# EAGLE design FAD4 (EAGLE 9.4.2)
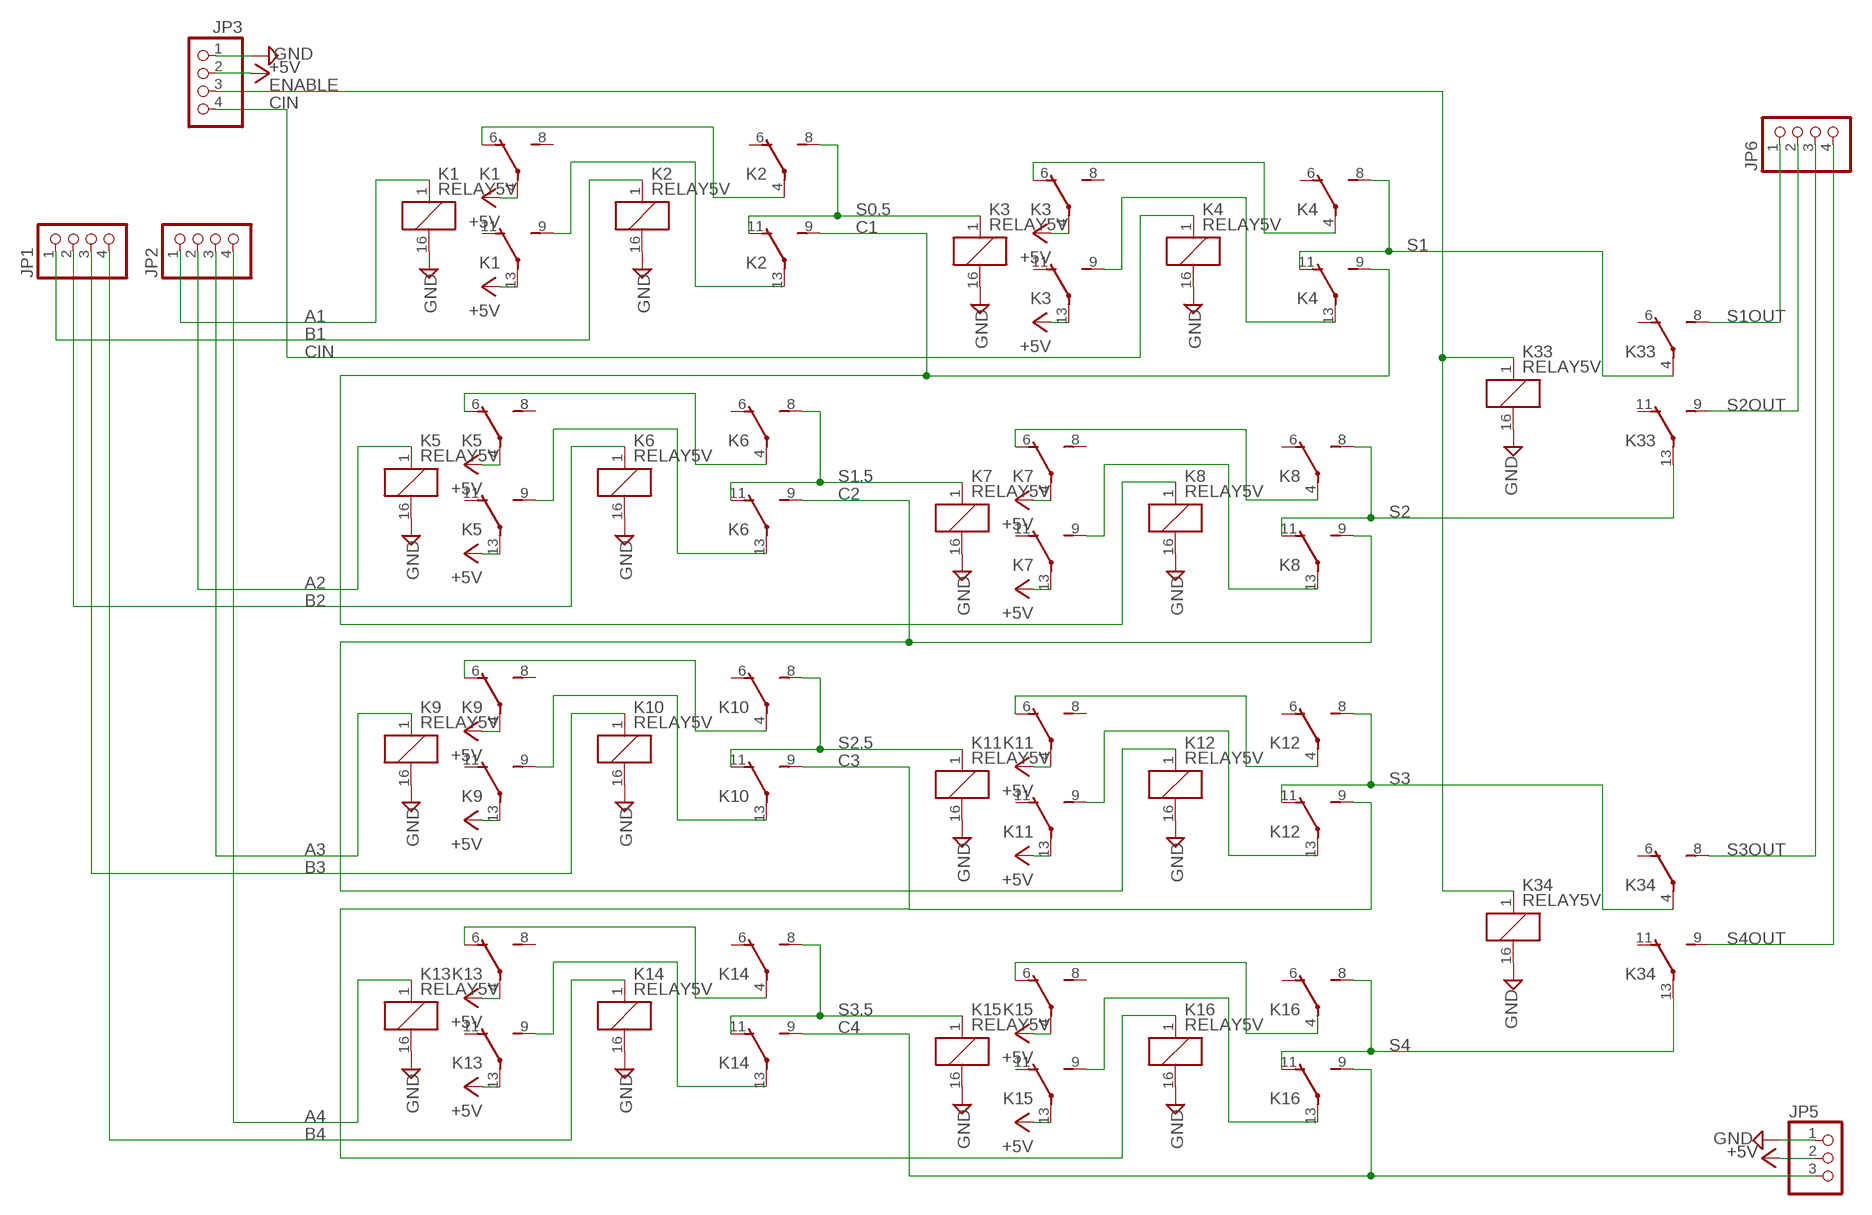
[diagram p0: schematic, sheet 1]

## Parts
JP1  PINHD-1X4  [1X04]
JP2  PINHD-1X4  [1X04]
JP3  PINHD-1X4  [1X04]
JP5  PINHD-1X3  [1X03]
JP6  PINHD-1X4  [1X04]
K1  RELAY5V  [DS-BT]
K2  RELAY5V  [DS-BT]
K3  RELAY5V  [DS-BT]
K4  RELAY5V  [DS-BT]
K5  RELAY5V  [DS-BT]
K6  RELAY5V  [DS-BT]
K7  RELAY5V  [DS-BT]
K8  RELAY5V  [DS-BT]
K9  RELAY5V  [DS-BT]
K10  RELAY5V  [DS-BT]
K11  RELAY5V  [DS-BT]
K12  RELAY5V  [DS-BT]
K13  RELAY5V  [DS-BT]
K14  RELAY5V  [DS-BT]
K15  RELAY5V  [DS-BT]
K16  RELAY5V  [DS-BT]
K33  RELAY5V  [DS-BT]
K34  RELAY5V  [DS-BT]

## Nets
+5V: JP3.2 JP5.2 K1.4(2:P) K1.13(3:P) K3.4(2:P) K3.13(3:P) K5.4(2:P) K5.13(3:P) K7.4(2:P) K7.13(3:P) K9.4(2:P) K9.13(3:P) K11.4(2:P) K11.13(3:P) K13.4(2:P) K13.13(3:P) K15.4(2:P) K15.13(3:P)
A1: JP2.1 K1.1(1:+)
A2: JP2.2 K5.1(1:+)
A3: JP2.3 K9.1(1:+)
A4: JP2.4 K13.1(1:+)
B1: JP1.1 K2.1(1:+)
B2: JP1.2 K6.1(1:+)
B3: JP1.3 K10.1(1:+)
B4: JP1.4 K14.1(1:+)
C1: K2.9(3:S) K4.9(3:S) K8.1(1:+)
C2: K6.9(3:S) K8.9(3:S) K12.1(1:+)
C3: K10.9(3:S) K12.9(3:S) K16.1(1:+)
C4: JP5.3 K14.9(3:S) K16.9(3:S)
CIN: JP3.4 K4.1(1:+)
ENABLE: JP3.3 K33.1(1:+) K34.1(1:+)
GND: JP3.1 JP5.1 K1.16(1:-) K2.16(1:-) K3.16(1:-) K4.16(1:-) K5.16(1:-) K6.16(1:-) K7.16(1:-) K8.16(1:-) K9.16(1:-) K10.16(1:-) K11.16(1:-) K12.16(1:-) K13.16(1:-) K14.16(1:-) K15.16(1:-) K16.16(1:-) K33.16(1:-) K34.16(1:-)
N$1: K3.9(3:S) K4.13(3:P)
N$2: K1.9(3:S) K2.13(3:P)
N$3: K1.6(2:O) K2.4(2:P)
N$4: K3.6(2:O) K4.4(2:P)
N$5: K5.9(3:S) K6.13(3:P)
N$6: K5.6(2:O) K6.4(2:P)
N$7: K7.9(3:S) K8.13(3:P)
N$8: K7.6(2:O) K8.4(2:P)
N$9: K9.9(3:S) K10.13(3:P)
N$10: K9.6(2:O) K10.4(2:P)
N$11: K11.9(3:S) K12.13(3:P)
N$12: K11.6(2:O) K12.4(2:P)
N$13: K13.9(3:S) K14.13(3:P)
N$14: K13.6(2:O) K14.4(2:P)
N$15: K15.9(3:S) K16.13(3:P)
N$16: K15.6(2:O) K16.4(2:P)
S0.5: K2.8(2:S) K2.11(3:O) K3.1(1:+)
S1: K4.8(2:S) K4.11(3:O) K33.4(2:P)
S1.5: K6.8(2:S) K6.11(3:O) K7.1(1:+)
S1OUT: JP6.1 K33.8(2:S)
S2: K8.8(2:S) K8.11(3:O) K33.13(3:P)
S2.5: K10.8(2:S) K10.11(3:O) K11.1(1:+)
S2OUT: JP6.2 K33.9(3:S)
S3: K12.8(2:S) K12.11(3:O) K34.4(2:P)
S3.5: K14.8(2:S) K14.11(3:O) K15.1(1:+)
S3OUT: JP6.3 K34.8(2:S)
S4: K16.8(2:S) K16.11(3:O) K34.13(3:P)
S4OUT: JP6.4 K34.9(3:S)
Unconnected: K1.8(2:S) K1.11(3:O) K2.6(2:O) K3.8(2:S) K3.11(3:O) K4.6(2:O) K5.8(2:S) K5.11(3:O) K6.6(2:O) K7.8(2:S) K7.11(3:O) K8.6(2:O) K9.8(2:S) K9.11(3:O) K10.6(2:O) K11.8(2:S) K11.11(3:O) K12.6(2:O) K13.8(2:S) K13.11(3:O) K14.6(2:O) K15.8(2:S) K15.11(3:O) K16.6(2:O) K33.6(2:O) K33.11(3:O) K34.6(2:O) K34.11(3:O)

## Library data of the parts
JP1-JP3 JP6 = pinhead:PINHD-1X4: PIN HEADER
JP5 = pinhead:PINHD-1X3: PIN HEADER
K1-K16 K33 K34 = My:RELAY: DS-BT RELAYS 4,000 V BREAKDOWN VOLTAGE NAiS Source: http://www.mew-europe.com/.. en_ds_61005_0010.pdf

## Board
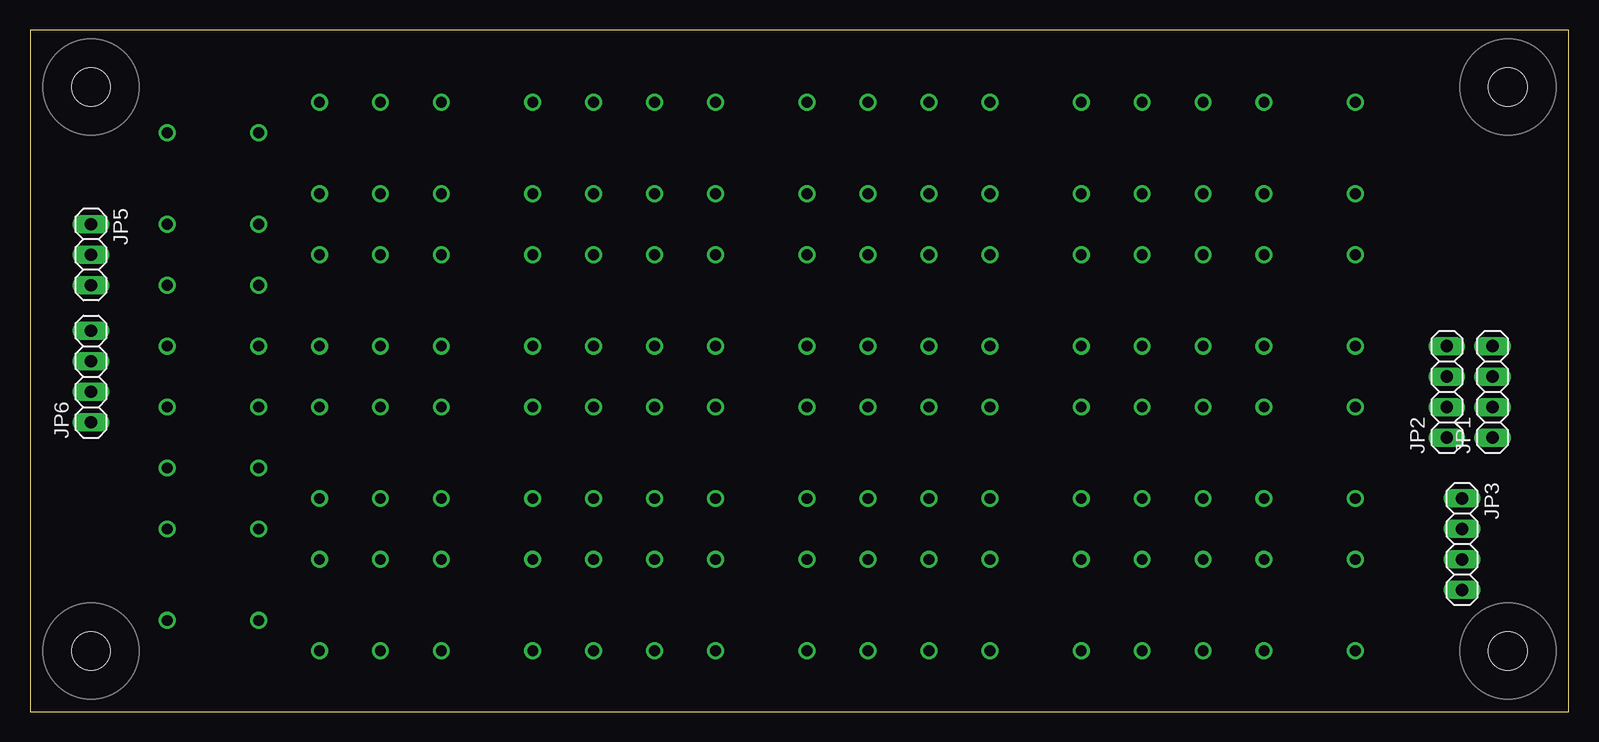
[diagram p1: board, top side]
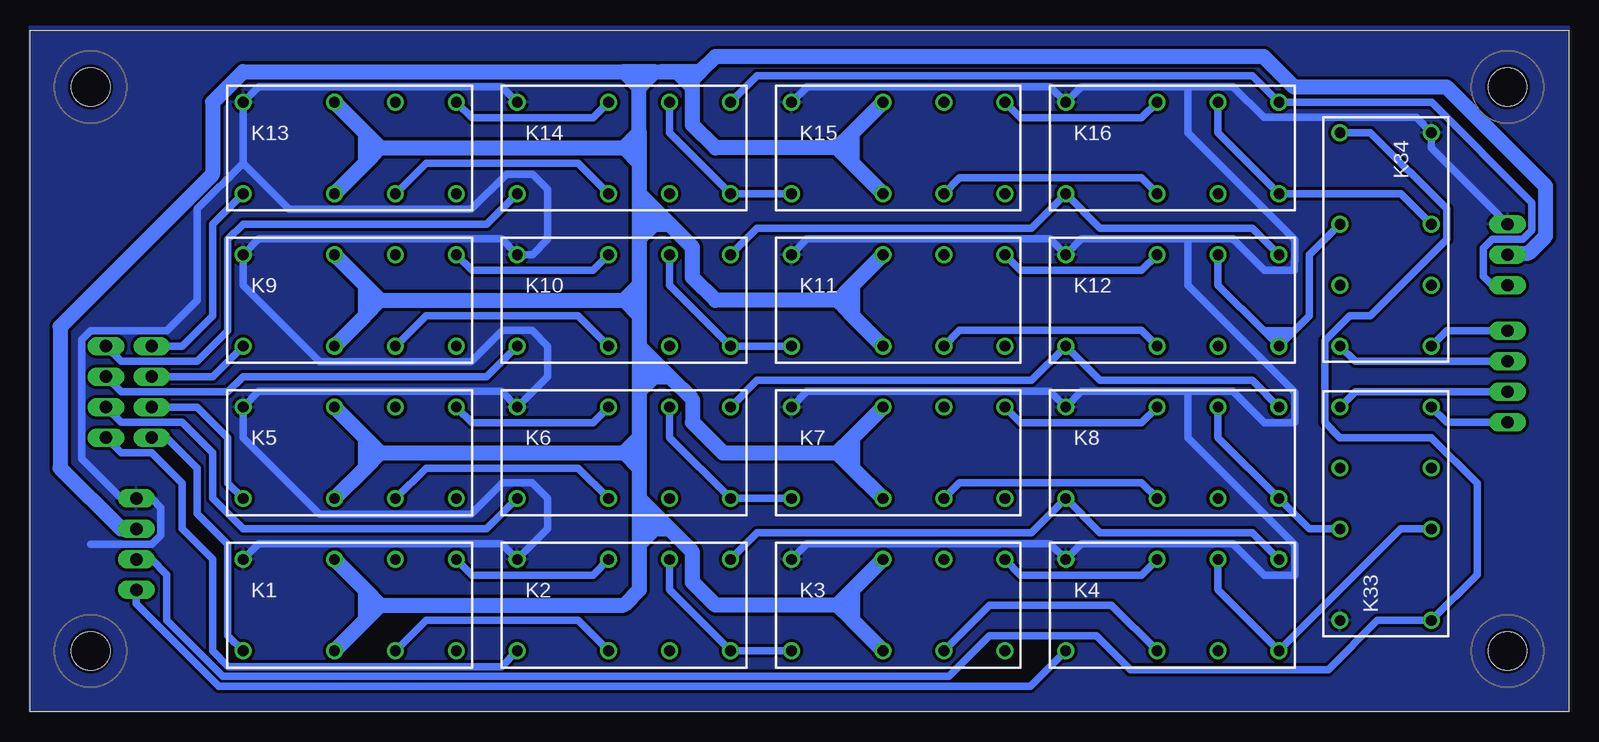
[diagram p2: board, bottom side, seen from below]

Size 128.25 x 56.82 mm. Coordinates in mm from the lower left corner, seen from the top.
Outline: 0,0 128.25,0 128.25,56.82 0,56.82 0,0
Copper layers (1*16): Top 0.0356mm / dielectric 1.5011mm / Bottom 0.0356mm
Design rules "formitaminimum": minimum track width 5mil, minimum drill 0.5994mm, track to track 0.2007mm, track to pad 0.2007mm, pad to pad 0.2007mm, via to via 0.2007mm, smd to smd 0mil, copper to edge 0mil, drill to drill 1mil, minimum pad ring 10mil, minimum via ring 8mil, stop-mask expansion 4mil, vias tented up to drill 1mm, thermal gap 10mil

### Footprints (pad centres in the part's own frame; a part is rotated, then mirrored left to right if it is on the bottom)
1X04 = drill 1.016 long: 1 -3.81,0; 2 -1.27,0; 3 1.27,0; 4 3.81,0
1X03 = drill 1.016 long: 1 -2.54,0; 2 0,0; 3 2.54,0
DS-BT = drill 0.9: 1 -8.89,-3.81; 4 -1.27,-3.81; 6 3.81,-3.81; 8 8.89,-3.81; 9 8.89,3.81; 11 3.81,3.81; 13 -1.27,3.81; 16 -8.89,3.81
HOLE_3.2 = hole 3.2: 0,0

### Placement (x,y rotation side)
JP1  121.92,26.67 90 top
JP2  118.11,26.67 90 top
JP3  119.38,13.97 270 top
JP5  5.08,38.1 270 top
JP6  5.08,27.94 90 top
K1  101.6,8.89 0 bottom
K2  78.74,8.89 0 bottom
K3  55.88,8.89 0 bottom
K4  33.02,8.89 0 bottom
K5  101.6,21.59 0 bottom
K6  78.74,21.59 0 bottom
K7  55.88,21.59 0 bottom
K8  33.02,21.59 0 bottom
K9  101.6,34.29 0 bottom
K10  78.74,34.29 0 bottom
K11  55.88,34.29 0 bottom
K12  33.02,34.29 0 bottom
K13  101.6,46.99 0 bottom
K14  78.74,46.99 0 bottom
K15  55.88,46.99 0 bottom
K16  33.02,46.99 0 bottom
K33  15.24,16.51 90 bottom
K34  15.24,39.37 270 bottom
U$1  [HOLE_3.2]  5.08,5.08 0 top
U$2  [HOLE_3.2]  5.08,52.07 0 top
U$3  [HOLE_3.2]  123.19,5.08 0 top
U$4  [HOLE_3.2]  123.19,52.07 0 top

### Tracks (layer width: path | path; a pad name or v marks a point on that pad's centre or on a via)
+5V
  Bottom 1.27: 60.96,46.99 59.69,45.72 | 59.69,45.72 K15.4 | 77.47,48.26 77.47,46.99 | 77.47,46.99 77.47,45.72 | 77.47,45.72 77.47,43.18 | 77.47,43.18 77.47,41.91 | 77.47,41.91 77.47,40.64 | 77.47,40.64 77.47,39.37 | 77.47,39.37 77.47,35.56 | 77.47,35.56 77.47,34.29 | 77.47,34.29 77.47,33.02 | 77.47,33.02 77.47,30.48 | 77.47,30.48 77.47,29.21 | 77.47,29.21 77.47,27.94 | 77.47,27.94 77.47,26.67 | 77.47,26.67 77.47,22.86 | 77.47,22.86 77.47,21.59 | 77.47,21.59 77.47,20.32 | 77.47,20.32 77.47,17.78 | 77.47,17.78 77.47,16.51 | 77.47,16.51 77.47,15.24 | 77.47,15.24 77.47,13.97 | 77.47,13.97 77.47,10.16 78.74,8.89 99.06,8.89 | 77.47,15.24 76.2,15.24 | 76.2,15.24 74.93,15.24 | 74.93,15.24 73.03,13.34 73.03,10.79 71.12,8.89 60.96,8.89 | 60.96,8.89 59.69,10.16 | 59.69,10.16 K3.13 | K3.4 59.69,7.62 | 59.69,7.62 60.96,8.89 | K7.13 59.69,22.86 | 59.69,22.86 60.96,21.59 | 74.93,27.94 73.03,26.04 73.03,24.13 70.48,21.59 60.96,21.59 | 76.2,27.94 74.93,27.94 | 76.2,27.94 77.47,27.94 | K7.4 59.69,20.32 | 59.69,20.32 60.96,21.59 | 77.47,29.21 76.2,27.94 | 76.2,27.94 77.47,26.67 | 76.2,40.64 74.93,40.64 | 60.96,34.29 60.33,34.92 | 60.33,34.92 59.69,35.56 | 59.69,35.56 K11.13 | K11.4 59.69,33.02 | 59.69,33.02 60.33,33.66 | 60.33,33.66 60.96,34.29 | 60.33,34.92 60.33,33.66 | 76.2,40.64 77.47,41.91 | 76.2,40.64 77.47,39.37 | K15.13 59.69,48.26 | 59.69,48.26 60.96,46.99 | 59.69,45.72 59.69,48.26 | 59.69,35.56 59.69,33.02 | 59.69,22.86 59.69,20.32 | 59.69,10.16 59.69,7.62 | 76.2,15.24 77.47,16.51 | 76.2,15.24 77.47,13.97 | K13.13 100.33,48.26 | 100.33,48.26 99.06,46.99 | 99.06,46.99 78.74,46.99 | 77.47,46.99 78.74,46.99 | 78.74,46.99 77.47,48.26 | 78.74,46.99 77.47,45.72 | K13.4 100.33,45.72 | 100.33,45.72 99.69,46.35
  Bottom 1.27: 99.69,46.35 99.06,46.99 | 100.33,48.26 100.33,45.72 | K9.13 100.33,35.56 | 100.33,35.56 99.06,34.29 | 99.06,34.29 78.74,34.29 | 77.47,34.29 78.74,34.29 | K9.4 100.33,33.02 | 100.33,33.02 99.06,34.29 | 100.33,35.56 100.33,33.02 | 77.47,35.56 78.74,34.29 | 78.74,34.29 77.47,33.02 | K5.13 100.33,22.86 | 100.33,22.86 99.06,21.59 | 99.06,21.59 78.74,21.59 | 77.47,21.59 78.74,21.59 | 99.06,21.59 100.33,20.32 | 100.33,20.32 K5.4 | 77.47,22.86 78.74,21.59 | 78.74,21.59 77.47,20.32 | K1.13 100.33,10.16 | 100.33,10.16 99.06,8.89 | 99.06,8.89 100.33,7.62 | 100.33,7.62 K1.4 | 74.93,40.64 73.03,38.73 73.03,36.2 71.12,34.29 60.96,34.29 | 60.96,46.99 71.12,46.99 73.03,48.9 73.03,52.07 | 76.2,40.64 77.47,40.64 | 100.33,22.86 100.33,20.32 | 100.33,10.16 100.33,7.62 | 76.19,53.35 77.47,53.35 | 77.47,53.35 78.74,53.35 | 78.74,53.35 78.73,53.34 | 72.39,53.34 71.12,54.61 25.4,54.61 22.86,52.07 10.16,52.07 1.91,43.82 1.91,39.64 3.32,38.23 4.95,38.23 JP5.2 | 72.39,53.34 73.66,53.34 | 73.66,53.34 74.3,53.34 | 75.57,53.35 75.56,53.34 74.3,53.34 | 73.03,52.07 73.03,52.7 | 72.39,53.34 73.03,52.7 | 73.03,52.7 73.66,53.34 | 77.47,48.26 77.47,52.07 | 77.47,52.07 77.47,53.35 | 76.19,53.35 77.47,52.07 | 76.19,53.35 75.57,53.35 | 77.47,52.07 78.74,53.34 78.74,53.35 | 75.57,53.35 72.4,53.35 72.39,53.34 | 73.03,52.07 74.3,53.34 | 74.93,15.24 77.47,17.78 | 74.93,27.94 77.47,30.48 | 74.93,40.64 77.47,43.18 | 78.74,53.35 110.49,53.35 113.03,50.8 113.03,44.79 125.73,32.09 125.73,20.32 120.65,15.24 JP3.2 | 99.69,46.35
A1
  Bottom 0.61: K1.1 111.76,6.35 111.76,13.97 114.3,16.51 114.3,20.32 116.84,22.86 JP2.1
A2
  Bottom 0.61: 116.84,25.4 JP2.2 114.3,25.4 111.76,22.86 111.76,19.05 K5.1
A3
  Bottom 0.61: JP2.3 113.03,27.94 K9.1
A4
  Bottom 0.61: JP2.4 115.57,30.48 113.03,33.02 113.03,40.64 K13.1
B1
  Bottom 0.61: K2.1 88.94,3.77 111.72,3.77 113.03,5.08 113.03,12.7 115.57,15.24 115.57,19.05 118.11,21.59 120.65,21.59 JP1.1
B2
  Bottom 0.61: K6.1 90.17,15.24 110.49,15.24 113.03,17.78 113.03,21.59 115.57,24.13 120.65,24.13 JP1.2
B3
  Bottom 0.61: JP1.3 120.65,26.67 111.76,26.67 110.49,27.94 90.17,27.94 K10.1
B4
  Bottom 0.61: K14.1 90.17,40.64 110.49,40.64 111.76,39.37 111.76,31.75 114.3,29.21 120.65,29.21 JP1.4
C1
  Bottom 0.61: K4.9 26.35,14.92 39.05,14.92 K8.1 44.77,14.92 67.63,14.92 K2.9
C2
  Bottom 0.61: K8.9 26.35,27.62 39.05,27.62 K12.1 44.77,27.62 67.63,27.62 K6.9
C3
  Bottom 0.61: K12.9 26.35,40.32 39.05,40.32 K16.1 44.77,40.32 67.63,40.32 K10.9
C4
  Bottom 0.61: K14.9 67.63,53.02 26.35,53.02 K16.9 11.41,50.8 3.05,42.44 3.05,40.12 3.79,39.37 3.81,39.37 6.35,39.37 6.37,39.37 7.11,38.62 7.11,37.58 7.11,36.32 6.35,35.56 JP5.3
CIN
  Bottom 0.61: K4.1 44.84,2.15 112.52,2.15 119.38,9.01 JP3.4
ENABLE
  Bottom 0.61: K34.1 16.51,48.26 10.16,41.91 10.16,39.37 16.51,33.02 18.22,33.02 20.32,30.92 20.32,24.13 19.05,22.86 11.43,22.86 7.62,19.05 7.62,11.43 K33.1 15.92,7.62 20.03,3.52 36.54,3.52 39.37,6.35 48.26,6.35 51.65,2.96 112.18,2.96 116.84,7.62 116.84,11.43 118.11,12.7 JP3.3
GND
  Bottom 0.61: 31.75,52.11 40.6,52.11 K16.16 43.22,52.11 63.5,52.11 63.5,52.07 K15.16 | 31.75,52.11 27.98,52.11 25.4,49.53 12.7,49.53 K34.16 11.43,46.99 JP5.1 | K11.16 63.46,39.41 43.22,39.41 K12.16 40.6,39.41 31.75,39.41 | K7.16 63.46,26.71 43.22,26.71 K8.16 40.6,26.71 31.75,26.71 | K3.16 63.46,14.01 43.22,14.01 K4.16 40.6,14.01 27.98,14.01 25.36,11.39 22.86,11.39 | 31.75,26.71 27.98,26.71 25.36,24.09 22.86,24.09 22.82,24.13 22.82,26.63 31.75,35.56 31.75,39.41 | 31.75,39.41 27.98,39.41 25.36,36.79 22.86,36.79 | 31.75,26.71 31.75,22.86 22.82,13.93 22.82,11.43 22.86,11.39 | 31.75,52.11 31.75,48.26 22.82,39.33 22.82,37.56 22.86,37.52 22.86,36.83 | 110.49,45.72 K13.16 109.18,52.11 88.94,52.11 K14.16 | 110.49,45.72 106.64,41.87 91.48,41.87 88.54,44.81 86.36,44.81 85.09,43.54 85.09,39.37 86.36,38.1 K10.16 88.94,39.41 109.18,39.41 K9.16 110.49,35.56 104.1,29.17 91.48,29.17 88.86,31.79 86.4,31.79 85.09,30.48 85.09,27.94 K6.16 88.94,26.71 109.18,26.71 K5.16 110.49,22.86 104.1,16.47 91.48,16.47 88.86,19.09 86.4,19.09 85.09,17.78 85.09,15.24 K2.16 88.94,14.01 109.18,14.01 K1.16 | 22.82,11.39 22.86,11.39 | 123.19,13.97 118.11,13.97 118.09,13.97 117.35,14.71 117.35,17.02 118.11,17.78 JP3.1 120.65,17.78 123.95,21.08 123.95,31 123.21,31.75 123.19,31.75 116.84,31.75 114.3,34.29 114.3,41.91 110.49,45.72
  pour Bottom (isolate 0.254): 0,57.15 0,0 128.27,0 128.27,57.15
N$1
  Bottom 0.61: K4.13 35.6,11.39 45.68,11.39 K3.9
N$2
  Bottom 0.61: K2.13 81.32,11.39 91.4,11.39 K1.9
N$3
  Bottom 0.61: K2.4 82.55,7.62 95.25,7.62 K1.6
N$4
  Bottom 0.61: K4.4 38.1,8.89 48.26,8.89 K3.6
N$5
  Bottom 0.61: K6.13 81.32,24.09 91.4,24.09 K5.9
N$6
  Bottom 0.61: K6.4 82.55,20.32 95.25,20.32 K5.6
N$7
  Bottom 0.61: K8.13 35.6,24.09 45.68,24.09 K7.9
N$8
  Bottom 0.61: K8.4 35.6,19.09 50.76,19.09 K7.6
N$9
  Bottom 0.61: K10.13 81.32,36.79 91.4,36.79 K9.9
N$10
  Bottom 0.61: K10.4 82.55,33.02 95.25,33.02 K9.6
N$11
  Bottom 0.61: K12.13 35.6,36.79 45.68,36.79 K11.9
N$12
  Bottom 0.61: K12.4 35.6,31.79 50.76,31.79 K11.6
N$13
  Bottom 0.61: K14.13 81.32,49.49 91.4,49.49 K13.9
N$14
  Bottom 0.61: K14.4 82.55,45.72 95.25,45.72 K13.6
N$15
  Bottom 0.61: K15.9 45.68,49.49 35.6,49.49 K16.13
N$16
  Bottom 0.61: K16.4 35.6,44.49 50.76,44.49 K15.6
S0.5
  Bottom 0.61: K2.11 74.93,10.16 K2.8 K3.1
S1
  Bottom 0.61: K4.11 29.21,10.16 K4.8 13.97,15.24 K33.4
S1.5
  Bottom 0.61: K6.11 74.93,22.86 K6.8 K7.1
S1OUT
  Bottom 0.61: JP6.1 10.16,24.13 K33.8
S2
  Bottom 0.61: K8.11 29.21,22.86 K8.8 21.59,15.24 K33.13
S2.5
  Bottom 0.61: K10.11 74.93,35.56 K10.8 K11.1
S2OUT
  Bottom 0.61: K33.9 17.78,26.67 JP6.2
S3
  Bottom 0.61: K12.11 29.21,35.56 25.4,31.75 | 25.4,31.75 24.77,31.11 | K34.4 21.59,38.1 21.59,33.02 22.86,31.75 | K12.8 23.5,31.11 | 23.5,31.11 22.86,31.75 | 22.86,31.75 24.13,31.75 | 24.13,31.75 25.4,31.75 | 23.5,31.11 24.13,31.75 | K12.8 24.77,31.11 | K12.8 24.13,31.75 | 24.13,31.75 24.77,31.11
S3.5
  Bottom 0.61: K14.11 74.93,48.26 K14.8 K15.1
S3OUT
  Bottom 0.61: JP6.3 17.78,29.21 K34.8
S4
  Bottom 0.61: K16.11 29.21,48.26 K16.8 13.97,43.18 K34.13
S4OUT
  Bottom 0.61: K34.9 10.16,31.75 JP6.4